# Altium project ALARA_Rocketry_PCB.PrjPcb
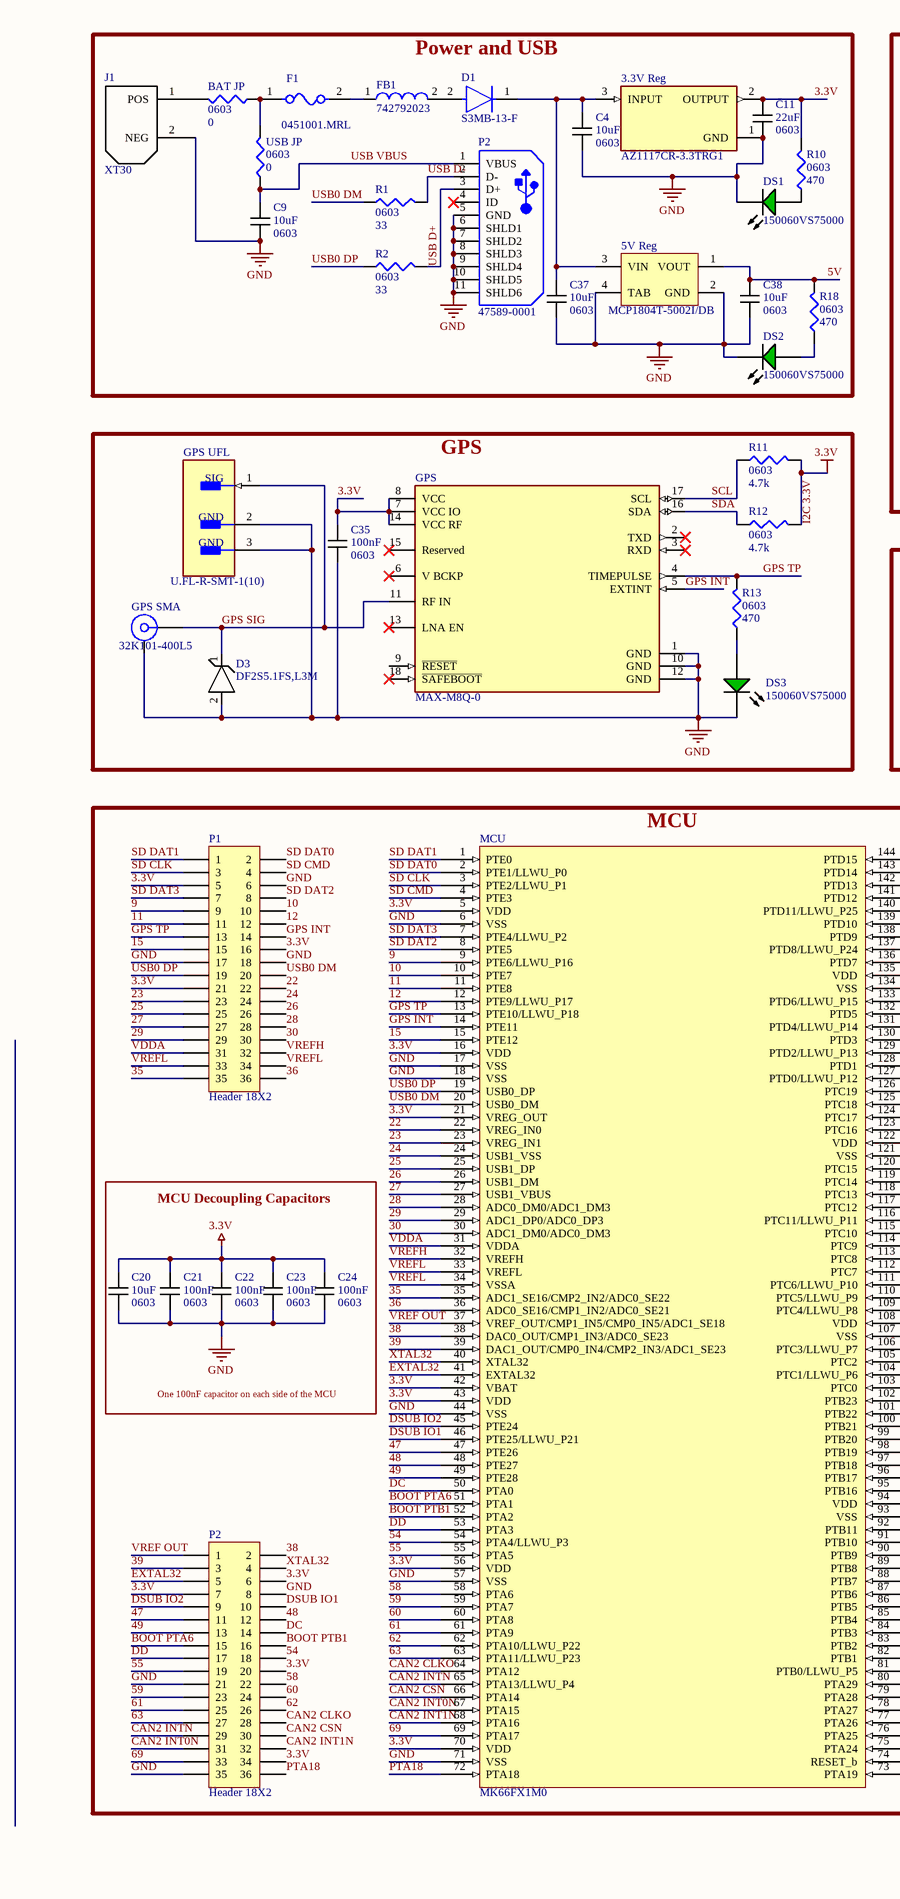
[diagram p0: Sheet1.SchDoc, left]
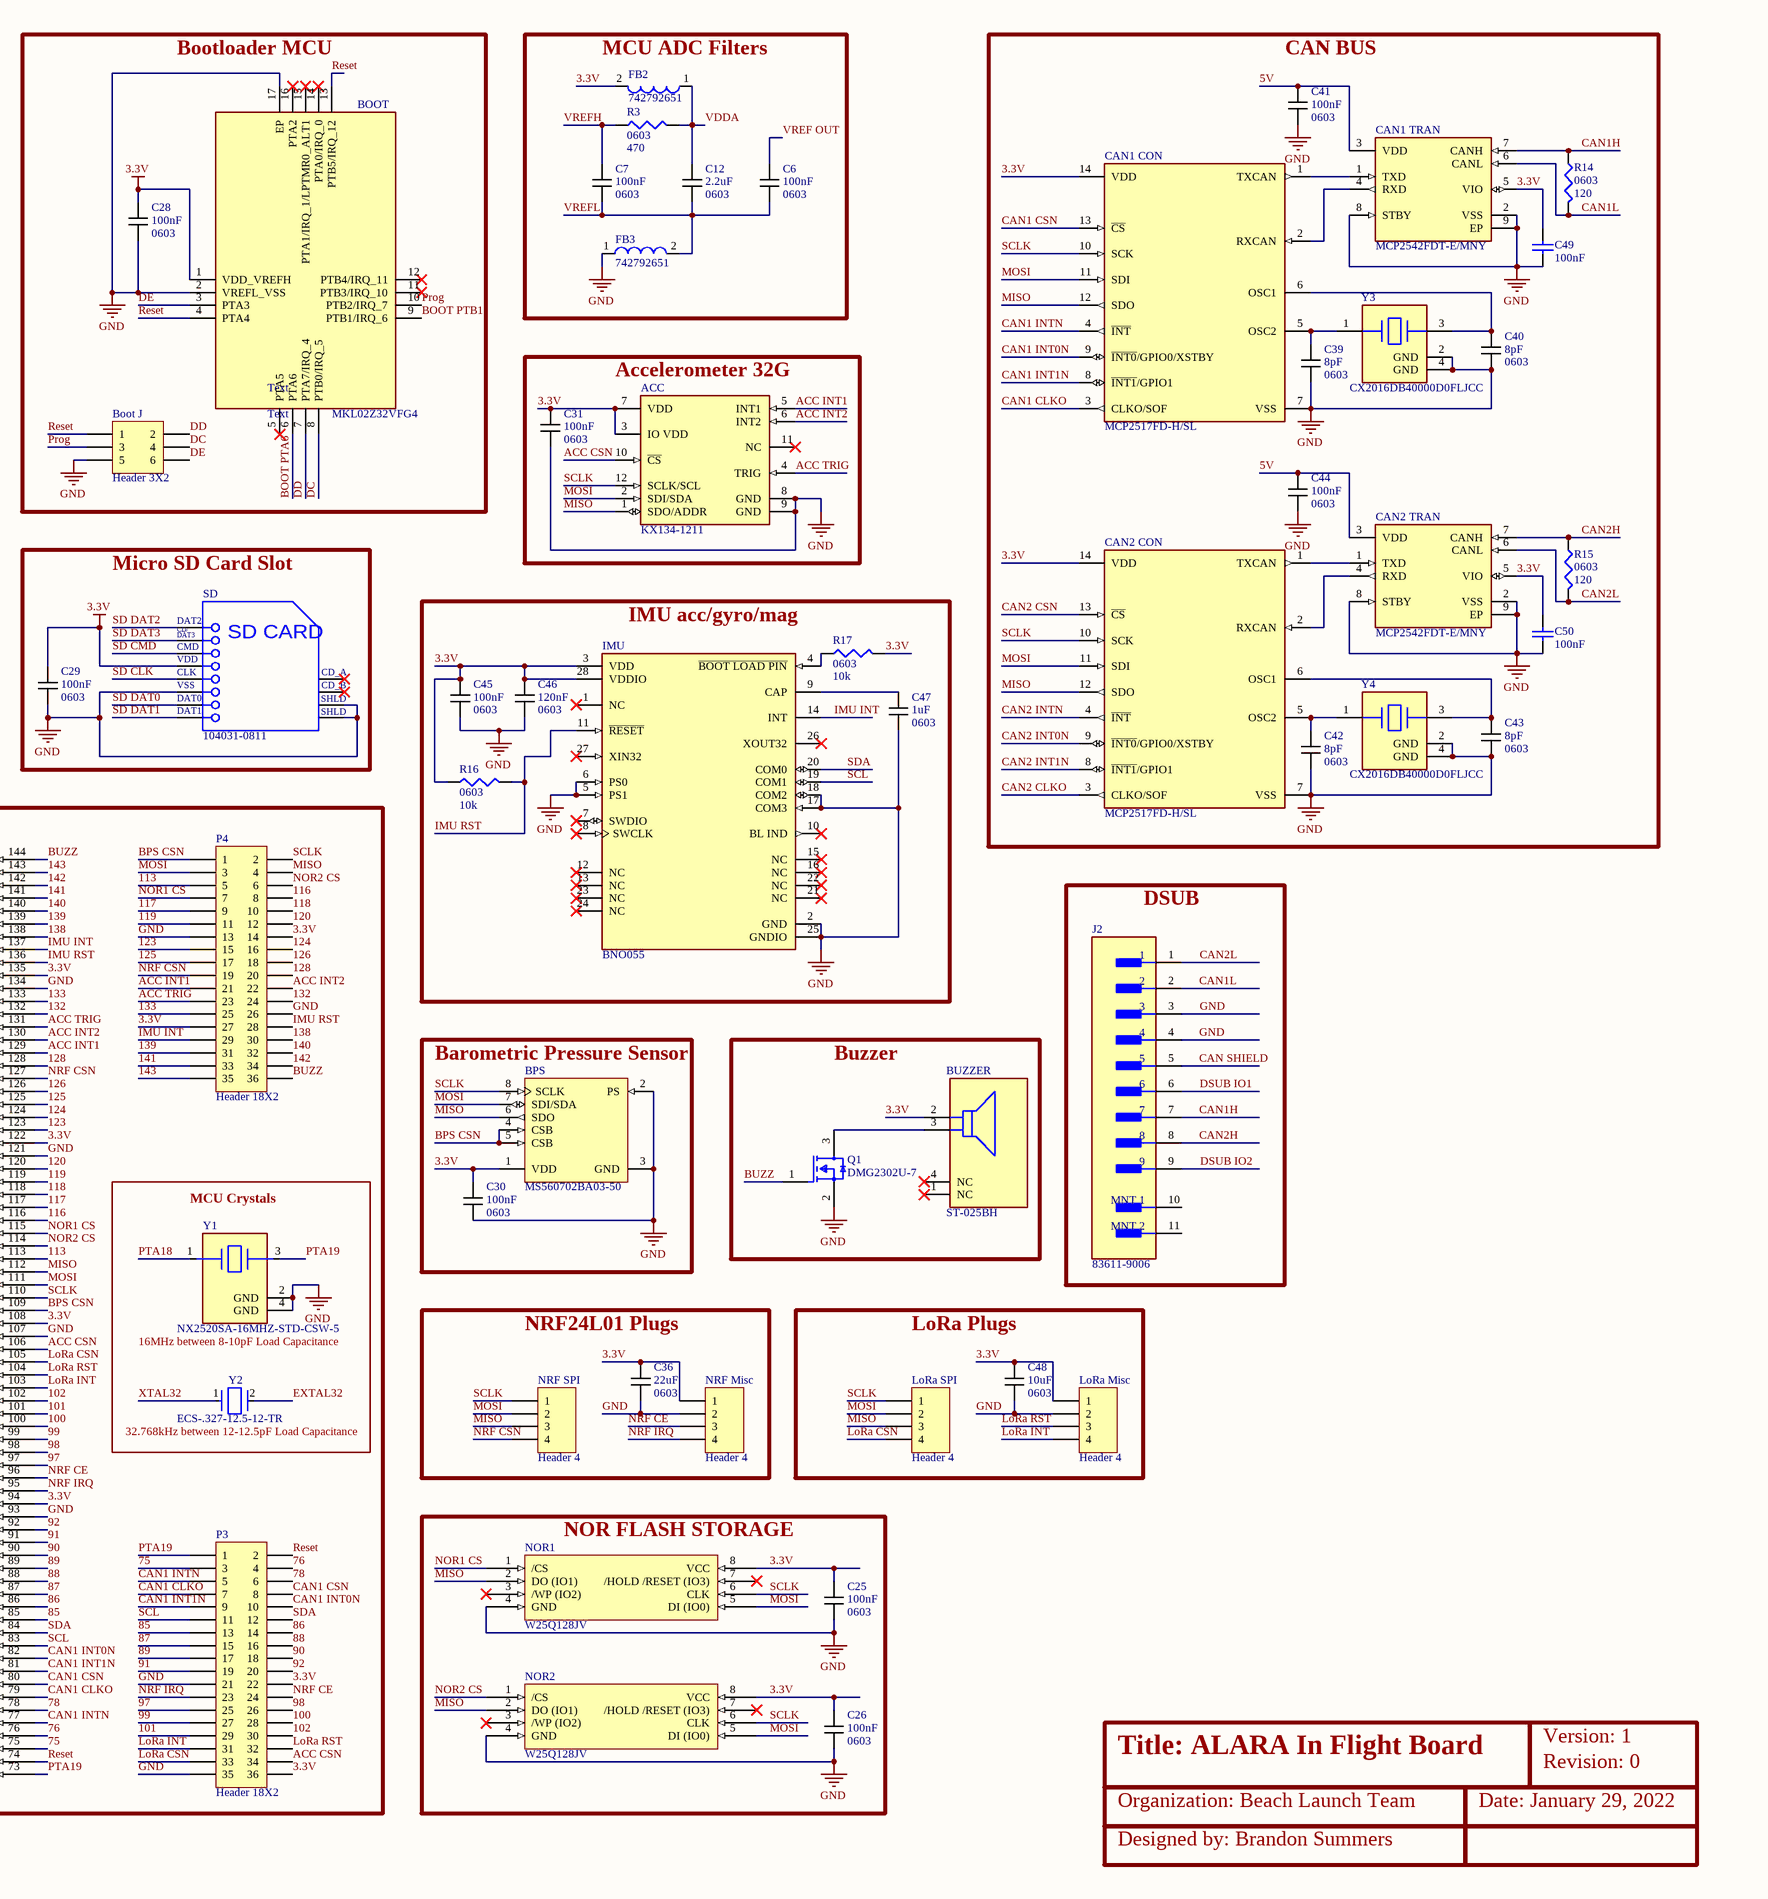
[diagram p1: Sheet1.SchDoc, right]
1 sheet, 91 parts. Net scope: global (net labels, ports and power ports of the same name join across sheets).
Board file: PCB1.PcbDoc

## Sheet Sheet1.SchDoc
size 508 x 381 mm; SheetNumber: 1; SheetTotal: 1

### Parts
(Parts that share a designator on the sheet are numbered #1, #2 ... from top to bottom, then left to right.)
3.3V_Reg  AZ1117CR-3.3TRG1  [FP-SOT89-MFG]
5V_Reg  MCP1804T-5002I/DB  [SOT-223-DB3_M]
ACC  KX134-1211  [FP-KX134-1211-MFG]
BAT_JP  0603  value 0  [J1-0603]
BOOT  MKL02Z32VFG4  [QFN50P300X300X65-17N-D]
Boot_J  Header 3X2  [HDR2X3]
BPS  MS560702BA03-50  [TECO-MS560702BA03-50_V]
BUZZER  ST-025BH  [FP-ST-025BH-MFG]
C4  10uF  [0603 Cap]
C6  100nF  [0603 Cap]
C7  100nF  [0603 Cap]
C9  10uF  [0603 Cap]
C11  22uF  [0603 Cap]
C12  2.2uF  [0603 Cap]
C20  10uF  [0603 Cap]
C21  100nF  [0603 Cap]
C22  100nF  [0603 Cap]
C23  100nF  [0603 Cap]
C24  100nF  [0603 Cap]
C25  100nF  [0603 Cap]
C26  100nF  [0603 Cap]
C28  100nF  [0603 Cap]
C29  100nF  [0603 Cap]
C30  100nF  [0603 Cap]
C31  100nF  [0603 Cap]
C35  100nF  [0603 Cap]
C36  22uF  [0603 Cap]
C37  10uF  [0603 Cap]
C38  10uF  [0603 Cap]
C39  8pF  [0603 Cap]
C40  8pF  [0603 Cap]
C41  100nF  [0603 Cap]
C42  8pF  [0603 Cap]
C43  8pF  [0603 Cap]
C44  100nF  [0603 Cap]
C45  100nF  [0603 Cap]
C46  120nF  [0603 Cap]
C47  1uF  [0603 Cap]
C48  10uF  [0603 Cap]
C49  100nF  [CAPC1608X95X40ML15T15]
C50  100nF  [CAPC1608X95X40ML15T15]
CAN1_CON  MCP2517FD-H/SL  [FP-C04-065-SL-MFG]
CAN1_TRAN  MCP2542FDT-E/MNY  [FP-C04-129-MNY-MFG]
CAN2_CON  MCP2517FD-H/SL  [FP-C04-065-SL-MFG]
CAN2_TRAN  MCP2542FDT-E/MNY  [FP-C04-129-MNY-MFG]
D1  S3MB-13-F  [FP-SMB-MFG]
D3  DF2S5.1FS,L3M  [Diode SOD-923]
DS1  150060VS75000  [WE-150060VS75000_V]
DS2  150060VS75000  [WE-150060VS75000_V]
DS3  150060VS75000  [WE-150060VS75000_V]
F1  0451001.MRL  [FP-0451-MFG]
FB1  742792023  [SMD-0805]
FB2  742792651  [SMD-0603]
FB3  742792651  [SMD-0603]
GPS  MAX-M8Q-0  [FP-MAX-M8Q-0-MFG]
GPS_SMA  32K101-400L5  [ROS-32K101-400L5_V]
GPS_UFL  U.FL-R-SMT-1(10)  [FP-U_FL-R-SMT-1_10-MFG]
IMU  BNO055  [FP-BNO055-MFG]
J1  XT30  [XT30]
J2  83611-9006  [FP-83611-9006-MFG]
LoRa_Misc  Header 4  [HDR1X4]
LoRa_SPI  Header 4  [HDR1X4]
MCU  MK66FX1M0  [LQFP144 0.5mm Pitch]
NOR1  omponent_1  [SOIC-8 - duplicate]  (value not drawn)
NOR2  omponent_1  [SOIC-8 - duplicate]  (value not drawn)
NRF_Misc  Header 4  [HDR1X4]
NRF_SPI  Header 4  [HDR1X4]
P1  Header 18X2  [HDR2X18]
P2#1  47589-0001  [MOLX-47589-0001_V]
P2#2  Header 18X2  [HDR2X18]
P3  Header 18X2  [HDR2X18]
P4  Header 18X2  [HDR2X18]
Q1  DMG2302U-7  [FP-SOT23-MFG]
R1  0603  value 33  [J1-0603]
R2  0603  value 33  [J1-0603]
R3  0603  value 470  [J1-0603]
R10  0603  value 470  [J1-0603]
R11  0603  value 4.7k  [J1-0603]
R12  0603  value 4.7k  [J1-0603]
R13  0603  value 470  [J1-0603]
R14  0603  value 120  [J1-0603]
R15  0603  value 120  [J1-0603]
R16  0603  value 10k  [J1-0603]
R17  0603  value 10k  [J1-0603]
R18  0603  value 470  [J1-0603]
SD  104031-0811  [MOLX-104031-0811_V]
USB_JP  0603  value 0  [J1-0603]
Y1  NX2520SA-16MHZ-STD-CSW-5  [FP-NX2520SA-MFG]
Y2  ECS-.327-12.5-12-TR  [FP-ECX-12-MFG]
Y3  CX2016DB40000D0FLJCC  [FP-CX2016DB-MFG]
Y4  CX2016DB40000D0FLJCC  [FP-CX2016DB-MFG]

### Blocks framed on the sheet
Power and USB: 3.3V_Reg 5V_Reg BAT_JP C4 C9 C11 C37 C38 D1 DS1 DS2 F1 FB1 J1 P2#1 R1 R2 R10 R18 USB_JP
Bootloader MCU: BOOT Boot_J C28
MCU ADC Filters: C6 C7 C12 FB2 FB3 R3
CAN BUS: C39-C44 C49 C50 CAN1_CON CAN1_TRAN CAN2_CON CAN2_TRAN R14 R15 Y3 Y4
Accelerometer 32G: ACC C31
GPS: C35 D3 DS3 GPS GPS_SMA GPS_UFL R11-R13
Micro SD Card Slot: C29 SD
IMU acc/gyro/mag: C45-C47 IMU R16 R17
MCU: MCU P1 P2#2 P3 P4
DSUB: J2
Barometric Pressure Sensor: BPS C30
Buzzer: BUZZER Q1
MCU Decoupling Capacitors: C20-C24
MCU Crystals: Y1 Y2
NRF24L01 Plugs: C36 NRF_Misc NRF_SPI
LoRa Plugs: C48 LoRa_Misc LoRa_SPI
NOR FLASH STORAGE: C25 C26 NOR1 NOR2

### Nets
3.3V: 3.3V_Reg.2(OUTPUT) ACC.3(IO_VDD) ACC.7(VDD) BOOT.1(VDD_VREFH) BPS.1(VDD) BUZZER.2(+POLARITY) C11.1 C20.1 C21.1 C22.1 C23.1 C24.1 C25.1 C26.1 C28.1 C29.1 C30.1 C31.1 C35.1 C36.1 C45.1 C46.1 C48.1 C49.2 C50.2 CAN1_CON.14(VDD) CAN1_TRAN.5(VIO) CAN2_CON.14(VDD) CAN2_TRAN.5(VIO) FB2.2 GPS.7(VCC_IO) GPS.8(VCC) GPS.14(VCC_RF) IMU.3(VDD) IMU.28(VDDIO) LoRa_Misc.1 MCU.5(VDD) MCU.16(VDD) MCU.21(VREG_OUT) MCU.42(VBAT) MCU.43(VDD) MCU.56(VDD) MCU.70(VDD) MCU.94(VDD) MCU.108(VDD) MCU.122(VDD) MCU.135(VDD) NOR1.8(VCC) NOR2.8(VCC) NRF_Misc.1 P1.5 P1.16 P1.21 P2#2.6 P2#2.7 P2#2.20 P2#2.34 P3.22 P3.36 P4.14 P4.27 R10.2 R11.2 R12.2 R16.1 R17.2 SD.4(VDD)
GND: 3.3V_Reg.1(GND) 5V_Reg.2(GND) 5V_Reg.4(TAB) ACC.8(GND) ACC.9(GND) BOOT.2(VREFL_VSS) BOOT.17(EP) Boot_J.5 BPS.2(PS) BPS.3(GND) C4.2 C9.2 C11.2 C20.2 C21.2 C22.2 C23.2 C24.2 C25.2 C26.2 C28.2 C29.2 C30.2 C31.2 C35.2 C36.2 C37.2 C38.2 C39.2 C40.2 C41.2 C42.2 C43.2 C44.2 C45.2 C46.2 C47.2 C48.2 C49.1 C50.1 CAN1_CON.7(VSS) CAN1_TRAN.2(VSS) CAN1_TRAN.8(STBY) CAN1_TRAN.9(EP) CAN2_CON.7(VSS) CAN2_TRAN.2(VSS) CAN2_TRAN.8(STBY) CAN2_TRAN.9(EP) D3.2 DS1.1(K) DS2.1(K) DS3.1(K) FB3.1 GPS.1(GND) GPS.10(GND) GPS.12(GND) GPS_SMA.MH GPS_UFL.2(GND) GPS_UFL.3(GND) IMU.2(GND) IMU.5(PS1) IMU.6(PS0) IMU.17(COM3) IMU.18(COM2) IMU.25(GNDIO) J1.2(NEG) J2.3 J2.4 LoRa_Misc.2 MCU.6(VSS) MCU.17(VSS) MCU.18(VSS) MCU.44(VSS) MCU.57(VSS) MCU.71(VSS) MCU.93(VSS) MCU.107(VSS) MCU.121(VSS) MCU.134(VSS) NOR1.4(GND) NOR2.4(GND) NRF_Misc.2 P1.6 P1.17 P1.18 P2#1.5(GND) P2#1.6(SHLD1) P2#1.7(SHLD2) P2#1.8(SHLD3) P2#1.9(SHLD4) P2#1.10(SHLD5) P2#1.11(SHLD6) P2#2.8 P2#2.21 P2#2.35 P3.21 P3.35 P4.13 P4.26 Q1.2(S) SD.6(VSS2) SD.11(SHLD1) SD.12(SHLD2) Y1.2(GND) Y1.4(GND) Y3.2(GND) Y3.4(GND) Y4.2(GND) Y4.4(GND)
5V: 5V_Reg.1(VOUT) C38.1 C41.1 C44.1 CAN1_TRAN.3(VDD) CAN2_TRAN.3(VDD) R18.2
9: MCU.9(PTE6/LLWU_P16) P1.9
10: MCU.10(PTE7) P1.10
11: MCU.11(PTE8) P1.11
12: MCU.12(PTE9/LLWU_P17) P1.12
15: MCU.15(PTE12) P1.15
22: MCU.22(VREG_IN0) P1.22
23: MCU.23(VREG_IN1) P1.23
24: MCU.24(USB1_VSS) P1.24
25: MCU.25(USB1_DP) P1.25
26: MCU.26(USB1_DM) P1.26
27: MCU.27(USB1_VBUS) P1.27
28: MCU.28(ADC0_DM0/ADC1_DM3) P1.28
29: MCU.29(ADC1_DP0/ADC0_DP3) P1.29
30: MCU.30(ADC1_DM0/ADC0_DM3) P1.30
35: MCU.35(ADC1_SE16/CMP2_IN2/ADC0_SE22) P1.35
36: MCU.36(ADC0_SE16/CMP1_IN2/ADC0_SE21) P1.36
38: MCU.38(DAC0_OUT/CMP1_IN3/ADC0_SE23) P2#2.2
39: MCU.39(DAC1_OUT/CMP0_IN4/CMP2_IN3/ADC1_SE23) P2#2.3
47: MCU.47(PTE26) P2#2.11
48: MCU.48(PTE27) P2#2.12
49: MCU.49(PTE28) P2#2.13
54: MCU.54(PTA4/LLWU_P3) P2#2.18
55: MCU.55(PTA5) P2#2.19
58: MCU.58(PTA6) P2#2.22
59: MCU.59(PTA7) P2#2.23
60: MCU.60(PTA8) P2#2.24
61: MCU.61(PTA9) P2#2.25
62: MCU.62(PTA10/LLWU_P22) P2#2.26
63: MCU.63(PTA11/LLWU_P23) P2#2.27
69: MCU.69(PTA17) P2#2.33
75: MCU.75(PTA24) P3.3
76: MCU.76(PTA25) P3.4
78: MCU.78(PTA27) P3.6
85: MCU.85(PTB4) P3.13
86: MCU.86(PTB5) P3.14
87: MCU.87(PTB6) P3.15
88: MCU.88(PTB7) P3.16
89: MCU.89(PTB8) P3.17
90: MCU.90(PTB9) P3.18
91: MCU.91(PTB10) P3.19
92: MCU.92(PTB11) P3.20
97: MCU.97(PTB18) P3.25
98: MCU.98(PTB19) P3.26
99: MCU.99(PTB20) P3.27
100: MCU.100(PTB21) P3.28
101: MCU.101(PTB22) P3.29
102: MCU.102(PTB23) P3.30
113: MCU.113(PTC8) P4.5
116: MCU.116(PTC11/LLWU_P11) P4.8
117: MCU.117(PTC12) P4.9
118: MCU.118(PTC13) P4.10
119: MCU.119(PTC14) P4.11
120: MCU.120(PTC15) P4.12
123: MCU.123(PTC16) P4.15
124: MCU.124(PTC17) P4.16
125: MCU.125(PTC18) P4.17
126: MCU.126(PTC19) P4.18
128: MCU.128(PTD1) P4.20
132: MCU.132(PTD5) P4.24
133: MCU.133(PTD6/LLWU_P15) P4.25
138: MCU.138(PTD9) P4.30
139: MCU.139(PTD10) P4.31
140: MCU.140(PTD11/LLWU_P25) P4.32
141: MCU.141(PTD12) P4.33
142: MCU.142(PTD13) P4.34
143: MCU.143(PTD14) P4.35
ACC CSN: ACC.10(~{CS}) MCU.106(PTC3/LLWU_P7) P3.34
ACC INT1: ACC.5(INT1) MCU.129(PTD2/LLWU_P13) P4.21
ACC INT2: ACC.6(INT2) MCU.130(PTD3) P4.22
ACC TRIG: ACC.4(TRIG) MCU.131(PTD4/LLWU_P14) P4.23
BOOT PTA6: BOOT.6(PTA6) MCU.51(PTA1) P2#2.15
BOOT PTB1: BOOT.9(PTB1/IRQ_6) MCU.52(PTA2) P2#2.16
BPS CSN: BPS.4(CSB) BPS.5(CSB) MCU.109(PTC4/LLWU_P8) P4.1
BUZZ: MCU.144(PTD15) P4.36 Q1.1(G)
CAN1 CLKO: CAN1_CON.3(CLKO/SOF) MCU.79(PTA28) P3.7
CAN1 CSN: CAN1_CON.13(~{CS}) MCU.80(PTA29) P3.8
CAN1 INT0N: CAN1_CON.9(~{INT0}/GPIO0/XSTBY) MCU.82(PTB1) P3.10
CAN1 INT1N: CAN1_CON.8(~{INT1}/GPIO1) MCU.81(PTB0/LLWU_P5) P3.9
CAN1 INTN: CAN1_CON.4(~{INT}) MCU.77(PTA26) P3.5
CAN1H: CAN1_TRAN.7(CANH) J2.7 R14.1
CAN1L: CAN1_TRAN.6(CANL) J2.2 R14.2
CAN2 CLKO: CAN2_CON.3(CLKO/SOF) MCU.64(PTA12) P2#2.28
CAN2 CSN: CAN2_CON.13(~{CS}) MCU.66(PTA14) P2#2.30
CAN2 INT0N: CAN2_CON.9(~{INT0}/GPIO0/XSTBY) MCU.67(PTA15) P2#2.31
CAN2 INT1N: CAN2_CON.8(~{INT1}/GPIO1) MCU.68(PTA16) P2#2.32
CAN2 INTN: CAN2_CON.4(~{INT}) MCU.65(PTA13/LLWU_P4) P2#2.29
CAN2H: CAN2_TRAN.7(CANH) J2.8 R15.1
CAN2L: CAN2_TRAN.6(CANL) J2.1 R15.2
CAN SHIELD: J2.5
DC: BOOT.8(PTB0/IRQ_5) Boot_J.4 MCU.50(PTA0) P2#2.14
DD: BOOT.7(PTA7/IRQ_4) Boot_J.2 MCU.53(PTA3) P2#2.17
DE: BOOT.3(PTA3) Boot_J.6
DSUB IO1: J2.6 MCU.46(PTE25/LLWU_P21) P2#2.10
DSUB IO2: J2.9 MCU.45(PTE24) P2#2.9
EXTAL32: MCU.41(EXTAL32) P2#2.5 Y2.2(Out/In)
GPS INT: GPS.5(EXTINT) MCU.14(PTE11) P1.14
GPS SIG: D3.1 GPS.11(RF_IN) GPS_SMA.1 GPS_UFL.1(SIG)
GPS TP: GPS.4(TIMEPULSE) MCU.13(PTE10/LLWU_P18) P1.13 R13.2
IMU INT: IMU.14(INT) MCU.137(PTD8/LLWU_P24) P4.29
IMU RST: IMU.11(~{RESET}) MCU.136(PTD7) P4.28 R16.2
LoRa CSN: LoRa_SPI.4 MCU.105(PTC2) P3.33
LoRa INT: LoRa_Misc.4 MCU.103(PTC0) P3.31
LoRa RST: LoRa_Misc.3 MCU.104(PTC1/LLWU_P6) P3.32
MISO: ACC.1(SDO/ADDR) BPS.6(SDO) CAN1_CON.12(SDO) CAN2_CON.12(SDO) LoRa_SPI.3 MCU.112(PTC7) NOR1.2(DO_(IO1)) NOR2.2(DO_(IO1)) NRF_SPI.3 P4.4
MOSI: ACC.2(SDI/SDA) BPS.7(SDI/SDA) CAN1_CON.11(SDI) CAN2_CON.11(SDI) LoRa_SPI.2 MCU.111(PTC6/LLWU_P10) NOR1.5(DI_(IO0)) NOR2.5(DI_(IO0)) NRF_SPI.2 P4.3
NOR1 CS: MCU.115(PTC10) NOR1.1(/CS) P4.7
NOR2 CS: MCU.114(PTC9) NOR2.1(/CS) P4.6
NRF CE: MCU.96(PTB17) NRF_Misc.3 P3.24
NRF CSN: MCU.127(PTD0/LLWU_P12) NRF_SPI.4 P4.19
NRF IRQ: MCU.95(PTB16) NRF_Misc.4 P3.23
Prog: BOOT.10(PTB2/IRQ_7) Boot_J.3
PTA18: MCU.72(PTA18) P2#2.36 Y1.1
PTA19: MCU.73(PTA19) P3.1 Y1.3
Reset: BOOT.4(PTA4) BOOT.13(PTB5/IRQ_12) Boot_J.1 MCU.74(RESET_b) P3.2
SCL: GPS.17(SCL) IMU.19(COM1) MCU.83(PTB2) P3.11 R11.1
SCLK: ACC.12(SCLK/SCL) BPS.8(SCLK) CAN1_CON.10(SCK) CAN2_CON.10(SCK) LoRa_SPI.1 MCU.110(PTC5/LLWU_P9) NOR1.6(CLK) NOR2.6(CLK) NRF_SPI.1 P4.2
SD CLK: MCU.3(PTE2/LLWU_P1) P1.3 SD.5(CLK)
SD CMD: MCU.4(PTE3) P1.4 SD.3(VSS1)
SD DAT0: MCU.2(PTE1/LLWU_P0) P1.2 SD.7(DAT0)
SD DAT1: MCU.1(PTE0) P1.1 SD.8(DAT1)
SD DAT2: MCU.8(PTE5) P1.8 SD.1(CD/DAT3)
SD DAT3: MCU.7(PTE4/LLWU_P2) P1.7 SD.2(CMD)
SDA: GPS.16(SDA) IMU.20(COM0) MCU.84(PTB3) P3.12 R12.1
USB0 DM: MCU.20(USB0_DM) P1.20 R1.1
USB0 DP: MCU.19(USB0_DP) P1.19 R2.1
USB D+: P2#1.3(D+) R2.2
USB D-: P2#1.2(D-) R1.2
USB VBUS: C9.1 P2#1.1(VBUS) USB_JP.1
VDDA: C12.1 FB2.1 MCU.31(VDDA) P1.31 R3.2
VREF OUT: C6.1 MCU.37(VREF_OUT/CMP1_IN5/CMP0_IN5/ADC1_SE18) P2#2.1
VREFH: C7.1 MCU.32(VREFH) P1.32 R3.1
VREFL: C6.2 C7.2 C12.2 FB3.2 MCU.33(VREFL) MCU.34(VSSA) P1.33 P1.34
XTAL32: MCU.40(XTAL32) P2#2.4 Y2.1(In/Out)
Net3.3V_Reg_3: 3.3V_Reg.3(INPUT) 5V_Reg.3(VIN) C4.1 C37.1 D1.1(C)
NetBAT_JP_1: BAT_JP.1 F1.1 USB_JP.2
NetBAT_JP_2: BAT_JP.2 J1.1(POS)
NetBUZZER_3: BUZZER.3(-POLARITY) Q1.3(D)
NetC39_1: C39.1 CAN1_CON.5(OSC2) Y3.1
NetC40_1: C40.1 CAN1_CON.6(OSC1) Y3.3
NetC42_1: C42.1 CAN2_CON.5(OSC2) Y4.1
NetC43_1: C43.1 CAN2_CON.6(OSC1) Y4.3
NetC47_1: C47.1 IMU.9(CAP)
NetCAN1_CON_1: CAN1_CON.1(TXCAN) CAN1_TRAN.1(TXD)
NetCAN1_CON_2: CAN1_CON.2(RXCAN) CAN1_TRAN.4(RXD)
NetCAN2_CON_1: CAN2_CON.1(TXCAN) CAN2_TRAN.1(TXD)
NetCAN2_CON_2: CAN2_CON.2(RXCAN) CAN2_TRAN.4(RXD)
NetD1_2: D1.2(A) FB1.2
NetDS1_2: DS1.2(A) R10.1
NetDS2_2: DS2.2(A) R18.1
NetDS3_2: DS3.2(A) R13.1
NetF1_2: F1.2 FB1.1
NetIMU_4: IMU.4(~{BOOT_LOAD_PIN}) R17.1

Not connected (* = marked no-connect by the designer): ACC 11(NC)*; BOOT 5(PTA5)* 11(PTB3/IRQ_10)* 12(PTB4/IRQ_11)* 14(PTA0/IRQ_0)* 15(PTA1/IRQ_1/LPTMR0_ALT1)* 16(PTA2)*; BUZZER 1(NC)* 4(NC)*; GPS 2(TXD)* 3(RXD)* 6(V_BCKP)* 9(~{RESET}) 13(LNA_EN)* 15(Reserved)* 18(~{SAFEBOOT})*; IMU 1(NC)* 7(SWDIO)* 8(SWCLK)* 10(BL_IND)* 12(NC)* 13(NC)* 15(NC)* 16(NC)* 21(NC)* 22(NC)* 23(NC)* 24(NC)* 26(XOUT32)* 27(XIN32)*; J2 10(MNT_1) 11(MNT_2); NOR1 3(/WP_(IO2))* 7(/HOLD_/RESET_(IO3))*; NOR2 3(/WP_(IO2))* 7(/HOLD_/RESET_(IO3))*; P2#1 4(ID)*; SD 9(CD_A)* 10(CD_B)*

### Notes on the sheet
- (near BOOT) Text
- One 100nF capacitor on each side of the MCU
- (near Y1) 16MHz between 8-10pF Load Capacitance
- (near Y2) 32.768kHz between 12-12.5pF Load Capacitance
- Title: ALARA In Flight Board
- Version: 1
- Revision: 0
- Designed by: Brandon Summers
- Organization: Beach Launch Team
- Date: January 29, 2022
- Labels drawn without touching a wire or pin: I2C 3.3V
- (in symbol C?) 0603
- (in symbol CMP-2000-05825-1) DAT2; CD/; DAT3; SD CARD; VSS; SHLD
- (in symbol Component_1) W25Q128JV

### Library data of the parts
3.3V_Reg = CMP-12756-000007-1: IC REG LINEAR 3.3V 800MA SOT89; Manufacturer: Diodes Inc.; Nominal Supply Current: 4mA; Output Type: Fixed; Accuracy Percentage: 1%; Max Junction Temp: +125°C; Max Supply Voltage: 15V; Number Of Outputs: 1; Output Current: 1.35A; Dropout Voltage: 1.2V; Device Class L1: Integrated Circuits (ICs); ComponentLink2URL: https://www.diodes.com/assets/Datasheets/AZ1117C.pdf; Temperature Range High: +125°C; Octopart: https://octopart.com/az1117cr-3.3trg1-diodes+inc.-30954805; Output Voltage: 3.3V; Automotive: No; RoHS: TRUE; Temperature Range Low: -20°C; Package: SOT89; Height: 1.6mm; Mouser Description: DiodesZetex AZ1117CR-3.3TRG1, LDO Regulator, 800mA, 3.3 V, ±1% 3-Pin, SOT-89; Manufacturer Part Number: AZ1117CR-3.3TRG1; ComponentLink2Description: Datasheet; Device Class L2: Power Management ICs; Lead Free: Yes; Device Class L3: Voltage Regulators - Linear; Category: IC; Temperature: -20°C to +125°C; Footprint Url: https://www.diodes.com/assets/Package-Files/SOT89.pdf; Digikey Description: IC REG LINEAR 3.3V 800MA SOT89
5V_Reg = CMP-0136-00510-1: 150 mA, 28V LDO Regulator With Shutdown, 3-Pin SOT-223, Industrial Temperature, Tape and Reel; PackageDescription: 3-Lead Plastic Small Outline Transistor (DB) [SOT-223]; PackageReference: SOT-223-DB3; PackageVersion: revBB, Aug-2009; DatasheetVersion: revB, Nov-2009
ACC = CMP-223024-000001-1: 105C OPERATING HIGHER BANDWIDTH,
BAT_JP R1-R3 R10-R18 USB_JP = Res3: Resistor; Published: 8-Jun-2000; LatestRevisionDate: 29-May-2009; LatestRevisionNote: IPC-7351 Footprint Added.; PackageReference: J1-0603; Publisher: Altium Limited; PackageDescription: Chip Resistor
BOOT = MKL02Z32VFG4: Integrated Circuit; Manufacturer_Name: NXP; Datasheet Link: http://www.nxp.com/docs/en/data-sheet/KL02P32M48SF0.pdf; Height: 0.65mm; Manufacturer_Part_Number: MKL02Z32VFG4; Mouser Part Number: 841-MKL02Z32VFG4; Mouser Price/Stock: https://www.mouser.co.uk/ProductDetail/NXP-Semiconductors/MKL02Z32VFG4?qs=RECgZY%252BK1xLpPFD7GzHxWg%3D%3D; Arrow Part Number: MKL02Z32VFG4; Arrow Price/Stock: https://www.arrow.com/en/products/mkl02z32vfg4/nxp-semiconductors
Boot_J = Header 3X2: Header, 3-Pin, Dual row; LatestRevisionDate: 17-Jul-2002; LatestRevisionNote: Re-released for DXP Platform.; Publisher: Altium Limited
BPS = CMP-2000-07512-1: Barometric Pressure Sensor, with Stainless Steel Cap , 1.8 to 3.6 V, -40 to 85 degC, 8-Pin SMD, RoHS, Tape and Reel; Manufacturer: TE Connectivity; Lead Free: LeadFree; RoHSCompliant: false; Mounting Technology: SurfaceMount; Datasheet URL: http://www.te.com/commerce/DocumentDelivery/DDEController?Action=showdoc&DocId=Data+Sheet%7FMS5607-02BA03%7FB2%7Fpdf%7FEnglish%7FENG_DS_MS5607-02BA03_B2.pdf%7FMS560702BA03-50; Manufacturer URL: http://www.te.com/; Package Description: 8-Pin Surface Mount Device, Body 3 x 5 mm, Pitch 1.25 mm; Package Reference: MS560702BA03-50; Datasheet Version: 06/2017
BUZZER = CMP-247804-000002-1: AUDIO MAGNETIC XDCR 2-4V SMD; Manufacturer: Soberton Inc.; Frequency: 2700Hz; Max Supply Voltage: 4.5V; Operating Supply Voltage: 3.6V; Current: 100mA; Min Supply Voltage: 2.5V; Octopart: https://octopart.com/st-025bh-soberton-22171825; Package: ST-025BH; Device Class L2: Audio Products; Device Class L3: Buzzers; ComponentLink2URL: https://www.soberton.com/wp-content/uploads/2019/02/ST-025BH-19-Feb-2019.pdf; Digikey Description: AUDIO MAGNETIC XDCR 2-4V SMD; Height: 3mm; Temperature: -30°C to +85°C; Temperature Range Low: -30°C; Lead Free: Yes; ComponentLink2Description: Datasheet; Device Class L1: Electromechanical; RoHS: TRUE; Category: Speak; Automotive: No; Temperature Range High: +85°C; Manufacturer Part Number: ST-025BH
C4 C6 C7 C9 C11 C12 C20-C26 C28-C31 C35-C48 = C?
C49 C50 = CMP-2006-01550-1: Manufacturer: Vitramon; Part Number: VJ0603Y104KXQCW1BC
CAN1_CON CAN2_CON = CMP-06298-000003-1: IC CANBUS CONTROLLER SPI 14SOIC; Manufacturer: Microchip; Interface: SPI,CAN; Nominal Supply Current: 15mA; Max Supply Voltage: 5.5V; Min Supply Voltage: 2.7V; Max Junction Temp: +165°C; Standoff Height: 0.1mm; ComponentLink2URL: http://ww1.microchip.com/downloads/en/DeviceDoc/MCP2517FD-External-CAN-FD-Controller-with-SPI-Interface-20005688B.pdf; ComponentLink2Description: Datasheet; Device Class L2: Interface ICs; Temperature Range Low: -40°C; Category: IC; Manufacturer Part Number: MCP2517FD-H/SL; Digikey Description: IC CANBUS CONTROLLER SPI 14SOIC; Ambient Temperature Range High: +150°C; Footprint Url: http://ww1.microchip.com/downloads/en/DeviceDoc/14L%20SOIC%203_90%20mm%20%28SL%29%20C04-00065d.pdf; Mouser Description: Stand-Alone Can Fd Controller w/Spi Interface, 14 Soic .150in Tube; Function: Controller; Device Class L3: Controllers; Ambient Temperature Range Low: -40°C; Octopart: https://octopart.com/mcp2517fd-h%2Fsl-microchip-83497369; Package: C04-065-SL; Temperature: -40°C to +150°C; Automotive: No; Ipc Land Pattern Name: SOIC127P600X175-14; Device Class L1: Integrated Circuits (ICs); RoHS: TRUE; Lead Free: Yes; Height: 1.75mm; Temperature Range High: +150°C
CAN1_TRAN CAN2_TRAN = CMP-06279-000021-1: IC TRANSCEIVER 1/1 8TDFN; Data Rate: 8Mbps; Receiver Hysteresis: 200mV; Mount: Surface Mount; RoHS Compliant: Yes; Max Operating Temperature: 125°C; Min Operating Temperature: -40°C; Packaging: Tape and Reel
D1 = CMP-12791-000030-1: DIODE GEN PURP 1KV 3A SMB; Manufacturer: Diodes Inc.; Peak Reverse Current: 10uA; Max Junction Temp: +150°C; Reverse Voltage: 1000V; Standoff Height: 0.05mm; Max Surge Forward Current: 100A; Capacitance: 40pF; Value: 40pF; Automotive: No; Device Class L1: Discrete Semiconductors; ComponentLink2Description: Datasheet; Temperature Range Low: -65°C; Lead Free: Yes; Height: 2.5mm; Device Class L3: Rectifier Diodes; Footprint Url: https://www.diodes.com/assets/Package-Files/SMB.pdf; Device Class L2: Diodes; Octopart: https://octopart.com/s3mb-13-f-diodes+inc.-333387; Temperature: -65°C to +150°C; ComponentLink2URL: https://www.diodes.com/assets/Datasheets/ds16005.pdf; RoHS: TRUE; Max Repetitive Reverse Voltage: 1000V; Package: SMB; Digikey Description: DIODE GEN PURP 1KV 3A SMB; Category: Diode; Manufacturer Part Number: S3MB-13-F; Forward Current: 3A; Mouser Description: Rectifiers 1000V 3A; Temperature Range High: +150°C
D3 NOR1 NOR2 = Component_1
DS1-DS3 = CMP-1426-00006-4: WL-SMCW SMD Chip LED Top View Monocolor Waterclear, 30 mA, 2 V, -40 to 85 degC, 2-Pin SMD, RoHS, Tape and Reel; DatasheetVersion: Rev. 2.7; PackageDescription: 2-Pin Surface Mount Device, Body 1.6 x 0.8 mm; ComponentLink1URL: https://www.we-online.com/; PartNumber: 150060VS75000; RoHSCompliant: True; ComponentLink2URL: http://katalog.we-online.de/led/datasheet/150060VS75000.pdf; ComponentLink1Description: Manufacturer URL; Mounting Technology: Surface Mount; ComponentLink2Description: Datasheet
F1 = CMP-08605-000061-1: FUSE BRD MNT 1A 125VAC/VDC 2SMD; Manufacturer: Littelfuse Inc; Resistance: 0.078Ω; Max Fuse Ac Voltage: 125V; Fuse Interrupt Dc Current: 300A; Fuse I2T: 0.6029A2Sec; Fuse Blow Speed: Fast; Value: 0.078Ω; Fuse Interrupt Ac Current: 50A; RoHS: TRUE; Octopart: https://octopart.com/0451001.mrl-littelfuse-566368; Temperature Range High: +125°C; Temperature: -55°C to +125°C; ComponentLink2Description: Datasheet; Voltage Rating: 125V; Digikey Description: FUSE BRD MNT 1A 125VAC/VDC 2SMD; Mouser Description: Surface Mount Fuses 125V 1A; Fuse Current: 1A; Device Class L1: Circuit Protection; Package: 0451; Lead Free: Yes; Device Class L3: unset; Category: Fuse; Automotive: No; Temperature Range Low: -55°C; ComponentLink2URL: https://www.littelfuse.com/~/media/electronics/datasheets/fuses/littelfuse_fuse_451_453_datasheet.pdf.pdf; Max Fuse Dc Voltage: 125V; Device Class L2: Fuses; Manufacturer Part Number: 0451001.MRL; Height: 2.94mm
FB1 = CMP-0220-00030-1: SMD EMI Suppression Ferrite Bead WE-CBF, Z = 120 Ohm; Impedance: 120 Ohm; PackageDescription: Chip Inductor, 2-Leads, Body 2.0 x 1.2 mm; ComponentLink2URL: http://www.we-online.de/katalog/media/pdf/742792023.pdf; ComponentLink1Description: Manufacturer Link; ComponentLink2Description: Datasheet; DatasheetVersion: Dec-2005; PackageReference: SMD-0805; ComponentLink1URL: http://www.we-online.com; PackageVersion: 2005
FB2 FB3 = CMP-0220-00181-1: SMD EMI Suppression Ferrite Bead WE-CBF, Z = 600 Ohm; Impedance: 600 Ohm; PackageReference: SMD-0603; PackageVersion: 2009; ComponentLink2Description: Datasheet; ComponentLink1Description: Manufacturer Link; ComponentLink2URL: http://www.we-online.de/katalog/media/pdf/742792651.pdf; DatasheetVersion: Dec-2005; ComponentLink1URL: http://www.we-online.com; PackageDescription: Chip Inductor, 2-Leads, Body 1.6 x 0.8 mm
GPS = CMP-207130-000017-1: RF RCVR GNSS/GPS 1.575GHZ 18LCC; Sensitivity: -167dBm; Current - Receiving: 23mA; Interface: I2C; Frequency: 1.575GHz; Min Operating Temperature: -40°C; Case/Package: SMD/SMT; RoHS Compliant: Yes; Packaging: Cut Tape; Max Operating Temperature: 85°C
GPS_SMA = CMP-0751-00001-1: SMA Straight Jack, Up to 18 GHz, -55 to 155 degC; Manufacturer: Rosenberger; Design Note: Footprint in library is a generic example - only application specific footprint delivers High Performance; PartNumber: 32K101-400L5; PackageDescription: SMA Straight Jack, 6.35 x 6.35 x 9.5 mm; ComponentLink5URL: http://www.rosenberger.com/en/contact/sales/; DatasheetVersion: a00; ComponentLink3URL: http://rosenberger.de/ok/images/documents/db/32K101-400L5.pdf; ComponentLink4Description: Series Overview / Design Note; ComponentLink5Description: Webshop / RFQ; PackageReference: 32K101-400L5; ComponentLink2Description: Datasheet; PackageVersion: a00; ComponentLink1Description: Manufacturer URL; ComponentLink3Description: Package Specification; ComponentLink2URL: http://rosenberger.de/ok/images/documents/db/32K101-400L5.pdf; Mounting Technology: Through Hole; ComponentLink1URL: http://www.rosenberger.de; ComponentLink4URL: http://rosenberger.de/ok/images/documents/spez/32.pdf
GPS_UFL = CMP-2000-05152-3: CONN U.FL RCPT STR 50 OHM SMD; Max Frequency: 6GHz; Connector Type: Coaxial; Body Plating: Silver; Body Material: Bronze; Impedance: 50R; Dielectric Material: Polymer; Insulation Resistance: 500MR; Gender: Male; Packaging: Cut Tape; Length: 3mm; Package Quantity: 2500; Termination: Solder; Lead Free: Lead Free; Series: U.FL; Min Operating Temperature: -40°C; Fastening Type: Snap; Contact Material: Brass; Orientation: Straight; Wire/Cable Type: Coaxial; Frequency: 6GHz; Contact Plating: Gold; Depth: 3.1mm; Weight: 0.001764oz; Max Operating Temperature: 90°C; Radiation Hardening: No; REACH SVHC: No SVHC; Mount: Surface Mount; Housing Color: Beige
IMU = CMP-2000-05075-4: IMU ACCEL/GYRO/MAG I2C 28LGA; Sensor Type: Accelerometer; Packaging: Tape and Reel; Case/Package: LGA; Min Operating Temperature: -40°C; Mount: Surface Mount; Output Type: I2C; Lead Free: Lead Free; Max Operating Temperature: 85°C
J2 = 572f0a5267336060156cc31caef0afa: CONN MICRO-D PLUG 9POS R/A SLDR; Plating: Steel; Shielding: Shielded; Number of Circuits: 9; Pitch: 1.27mm; Voltage Rating: 350V; Number of Ports: 1; Gender: Male; Current Rating: 1A; Insulation Resistance: 5GR; Lead Free: Lead Free; Contact Plating: Gold; Contact Material: Copper; Series: Micro D; Max Operating Temperature: 125°C; Color: Black; Mount: Through Hole; REACH SVHC: No SVHC; Termination: Solder; Radiation Hardening: No; Number of Contacts: 9; Width: 16.89mm; Depth: 7.82mm; Shell Material: Steel; Packaging: Rail/Tube; ELV: Compliant; Number of Positions: 9; Max Supply Voltage: 350V; Housing Color: Black; Flammability Rating: UL94 V-0; Length: 19.94mm; Number of Terminals/Pins: 9; Shell Size: E; Halogen Free: Low Halogen; Number of Rows: 2; Housing Material: Steel; Min Operating Temperature: -55°C; Package Quantity: 156; Voltage Rating (AC): 350V; Orientation: Right Angle
LoRa_Misc LoRa_SPI NRF_Misc NRF_SPI = Header 4: Header, 4-Pin; LatestRevisionDate: 17-Jul-2002; LatestRevisionNote: Re-released for DXP Platform.; Publisher: Altium Limited
MCU = COMPONENT_1
P1 P2#2 P3 P4 = Header 18X2: Header, 18-Pin, Dual row; LatestRevisionDate: 17-Jul-2002; LatestRevisionNote: Re-released for DXP Platform.; Publisher: Altium Limited
P2#1 = CMP-2000-05610-1: Right Angle Female Type AB Micro USB Connector, 30 V, 1.8 A, -30 to 85 degC, RoHS, Tape and Reel; Number of Ports: 1Port; Current Rating: 1.8A; Brand: Molex; Connector Type: MicroUSBTypeABreceptacle; Number of Contacts: 5Contact; Voltage Rating: 30VAC; Color: Black; Product: MicroUSBTypeABConnectors; Package URL: http://www.molex.com/pdm_docs/sd/475890001_sd.pdf; Contact Plating: Gold; Datasheet URL: http://www.molex.com/webdocs/datasheets/pdf/en-us/0475890001_IO_CONNECTORS.pdf; Operating Temperature Range: -20Cto+85C; Termination Style: SMD/SMT; Mounting Angle: Right; Package Reference: 47589-0001; Gender: Female; Package Description: Micro USB Connector, Pitch 0.65 mm, 5 Positions, Body 7.5 x 5.6 mm; Mounting Technology: SurfaceMount; Contact Material: CopperAlloy; Packaging: Reel; RoHS: True; Standard: USB; Manufacturer URL: http://www.molex.com/; Manufacturer: Molex; Datasheet Version: 12/2016; Product Category: USBConnectors; Series: 47589
Q1 = CMP-12801-000103-1: MOSFET N-CH 20V 4.2A SOT23; Fall Time: 6.7ns; Threshold Voltage: 1V; Element Configuration: Single; FET Type: 1 N-Channel; Rise Time: 9.8ns; Max Power Dissipation: 800mW; Rds On Max: 90mR; Number of Channels: 1; Gate to Source Voltage (Vgs): 8V; Turn-On Delay Time: 7.4ns; Turn-Off Delay Time: 28.1ns; Input Capacitance: 594.3pF; Drain to Source Voltage (Vdss): 20V; Width: 1.4mm; Package Quantity: 3000; Max Operating Temperature: 150°C; Packaging: Tape and Reel; Mount: Surface Mount; Number of Pins: 3; Min Operating Temperature: -55°C; Weight: 0.000282oz; REACH SVHC: No SVHC; Number of Elements: 1; Radiation Hardening: No; Length: 3mm; Height: 1mm; Lead Free: Lead Free; Drain to Source Breakdown Voltage: 20V; On-State Resistance: 90MR; Case/Package: SOT-23-3; Continuous Drain Current (ID): 4.2A; Power Dissipation: 800mW; Drain to Source Resistance: 90mR
SD = CMP-2000-05825-1: Micro SD Card, RA, -25 to 85 degC, 8-Pin SMD, RoHS, Tape and Reel; Voltage Rating: 10VAC/DC; Number of Contacts: 8; Insertion - Extraction Style: Push-Pull; Pitch: 1.1mm; Mating Cycles: 10000; Brand: Molex; Current Rating: 500mA; Manufacturer URL: http://www.molex.com/; Card Type: microSD; Mounting Type: Standard; Height: 1.42mm; Mounting Technology: SurfaceMount; Contact Plating: Gold; Product Category: MemoryCardConnectors; Package Description: 8-Pin Surface Mount Device, Body 11.95 x 11.4 mm, Pitch 1.1 mm; Datasheet URL: http://www.molex.com/pdm_docs/sd/1040310811_sd.pdf; Termination Style: SMD; Length: 11.4mm; Housing Material: LiquidCrystalPolymer(LCP); Orientation: RightAngle; RoHS: True; Contact Material: PhosphorBronze; Datasheet Version: Rev. E, 04/2006; Packaging: Reel; Manufacturer: Molex; Series: 104031; Product: CardConnectors; Number of Rows: 1Row; Package Reference: 104031-0811
Y1 = CMP-2000-05279-2: CRYSTAL 16.0000MHZ 8PF SMD; Series Resistance: 80R; Frequency: 16MHz; Frequency Tolerance: 15ppm; Frequency Stability: 25ppm; Mount: Surface Mount; Height: 0.022inch; Length: 0.098inch; ESR (Equivalent Series Resistance): 80R; Packaging: Tape and Reel; Min Operating Temperature: -40°C; Width: 0.079inch; Number of Pins: 4; Case/Package: SMD/SMT; Max Operating Temperature: 85°C; Load Capacitance: 8pF; Package Quantity: 3000
Y2 = CMP-40224-000024-1: CRYSTAL 32.7680KHZ 12.5PF SMD; Tolerance: 20ppm; ESR (Equivalent Series Resistance): 90kR; Frequency Stability: -0.03ppm; Frequency: 32.768kHz; Width: 1.2mm; Package Quantity: 1; Lead Free: Lead Free; Case/Package: SMD/SMT; Termination: SMD/SMT; Min Operating Temperature: -40°C; Height: 0.024inch; Number of Pins: 2; Max Operating Temperature: 85°C; Frequency Tolerance: 20ppm; Mount: Surface Mount; Packaging: Tape and Reel; Length: 0.079inch; Load Capacitance: 12.5pF
Y3 Y4 = CMP-20727-000002-1: CRYSTAL 40.0000MHZ 8PF SMD; Manufacturer: Kyocera International Inc. Electronic Components; Esr: 50Ω; Tolerance: 15ppm; Frequency: 40MHz; Series: CX2016DB; RoHS: TRUE; Temperature Range High: +85°C; Height: 0.45mm; Manufacturer Part Number: CX2016DB40000D0FLJCC; ComponentLink2Description: Datasheet; Load Capacitance: 8pF; ComponentLink2URL: https://global.kyocera.com/prdct/electro/product/pdf/cx2016db_e.pdf; Temperature: -30°C to +85°C; Device Class L2: Crystals / Oscillators; Category: Crys; Mouser Description: Crystal 40MHz 8pF 4-Pin SMD T/R; Lead Free: Yes; Device Class L3: Crystals; Temperature Range Low: -30°C; Octopart: https://octopart.com/cx2016db40000d0fljcc-avx+%2F+kyocera-71139660; Device Class L1: Passive Components; Automotive: No; Digikey Description: CRYSTAL 40.0000MHZ 8PF SMD; Package: CX2016DB; Stability: 15ppm